# Altium schematic sheet Safety_2019_V_3_0_Power_IC's.SchDoc
size A
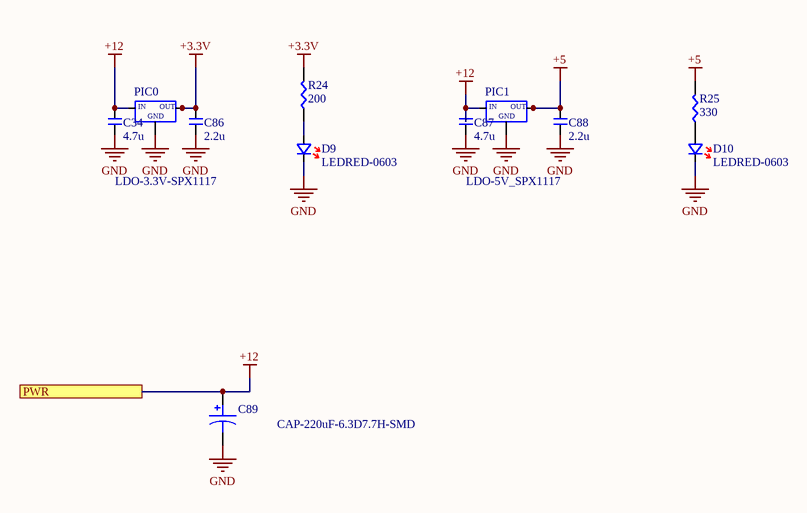
[diagram p0: Safety_2019_V_3_0_Power_IC's.SchDoc]

## Parts
C34  4.7u  [CAP-0603]
C86  2.2u  [CAP-0603]
C87  4.7u  [CAP-0603]
C88  2.2u  [CAP-0603]
C89  CAP-220uF-6.3D7.7H-SMD  [CAP-6.3D7.7H-SMD]
D9  LEDRED-0603  [LEDRED-0603]
D10  LEDRED-0603  [LEDRED-0603]
PIC0  LDO-3.3V-SPX1117  [SOT223]
PIC1  LDO-5V_SPX1117  [SOT223]
R24  200  [RES-0603]
R25  330  [RES-0603]

## Ports
PWR

## Nets
+3.3V: C86.2 PIC0.2 PIC0.4 R24.2
+5: C88.2 PIC1.2 PIC1.4 R25.2
+12: C34.2 C87.2 C89.POS(+) PIC0.3 PIC1.3 ; port PWR
GND: C34.1 C86.1 C87.1 C88.1 C89.NEG(-) D9.K D10.K PIC0.1 PIC1.1
NetD9_A: D9.A R24.1
NetD10_A: D10.A R25.1

## Notes on the sheet
- (in symbol LDO-SOT223_SPX1117) IN; OUT; GND

## Library data of the parts
C34 C86-C88 = CAP-0603
C89 = CAP-6.3D7.7H-SMD
PIC0 PIC1 = LDO-SOT223_SPX1117
R24 R25 = RES-0603